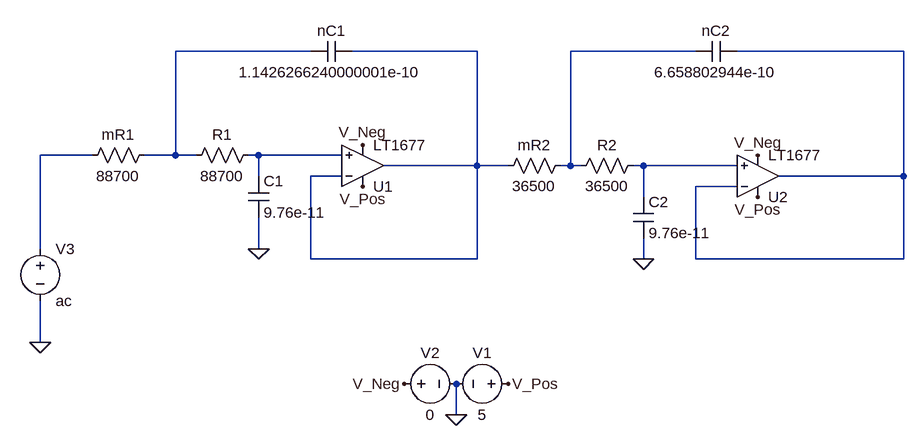
[diagram p0: schematic UnityGain4thOrderFilter.asc]
UnityGain4thOrderFilter.asc, the LTspice schematic file:
Version 4
SHEET 1 1728 680
WIRE 496 64 288 64
WIRE 752 64 560 64
WIRE 1088 64 896 64
WIRE 1408 64 1152 64
WIRE 160 224 80 224
WIRE 288 224 288 64
WIRE 288 224 240 224
WIRE 320 224 288 224
WIRE 416 224 400 224
WIRE 544 224 416 224
WIRE 752 240 752 64
WIRE 752 240 608 240
WIRE 800 240 752 240
WIRE 896 240 896 64
WIRE 896 240 880 240
WIRE 912 240 896 240
WIRE 1008 240 992 240
WIRE 1152 240 1008 240
WIRE 416 256 416 224
WIRE 544 256 496 256
WIRE 1408 256 1408 64
WIRE 1408 256 1216 256
WIRE 1152 272 1088 272
WIRE 1008 288 1008 240
WIRE 80 368 80 224
WIRE 416 368 416 320
WIRE 496 384 496 256
WIRE 752 384 752 240
WIRE 752 384 496 384
WIRE 1008 384 1008 352
WIRE 1088 384 1088 272
WIRE 1408 384 1408 256
WIRE 1408 384 1088 384
WIRE 80 512 80 448
WIRE 720 624 720 576
FLAG 416 368 0
FLAG 1008 384 0
FLAG 720 624 0
FLAG 800 576 V_Pos
FLAG 640 576 V_Neg
FLAG 80 512 0
FLAG 1184 288 V_Pos
FLAG 576 272 V_Pos
FLAG 576 208 V_Neg
FLAG 1184 224 V_Neg
SYMBOL res 256 208 R90
WINDOW 0 0 56 VBottom 2
WINDOW 3 32 56 VTop 2
SYMATTR InstName mR1
SYMATTR Value 88700
SYMBOL res 416 208 R90
WINDOW 0 0 56 VBottom 2
WINDOW 3 32 56 VTop 2
SYMATTR InstName R1
SYMATTR Value 88700
SYMBOL cap 400 256 R0
SYMATTR InstName C1
SYMATTR Value 9.76e-11
SYMBOL cap 560 48 R90
WINDOW 0 0 32 VBottom 2
WINDOW 3 32 32 VTop 2
SYMATTR InstName nC1
SYMATTR Value 1.1426266240000001e-10
SYMBOL res 896 224 R90
WINDOW 0 0 56 VBottom 2
WINDOW 3 32 56 VTop 2
SYMATTR InstName mR2
SYMATTR Value 36500
SYMBOL res 1008 224 R90
WINDOW 0 0 56 VBottom 2
WINDOW 3 32 56 VTop 2
SYMATTR InstName R2
SYMATTR Value 36500
SYMBOL cap 1152 48 R90
WINDOW 0 0 32 VBottom 2
WINDOW 3 32 32 VTop 2
SYMATTR InstName nC2
SYMATTR Value 6.658802944e-10
SYMBOL cap 992 288 R0
SYMATTR InstName C2
SYMATTR Value 9.76e-11
SYMBOL voltage 816 576 R90
WINDOW 0 -32 56 VBottom 2
WINDOW 3 32 56 VTop 2
SYMATTR InstName V1
SYMATTR Value 5
SYMBOL voltage 624 576 R270
WINDOW 0 32 56 VTop 2
WINDOW 3 -32 56 VBottom 2
SYMATTR InstName V2
SYMATTR Value 0
SYMBOL voltage 80 352 R0
WINDOW 123 0 0 Left 0
WINDOW 39 0 0 Left 0
SYMATTR InstName V3
SYMATTR Value ac
SYMBOL Opamps\\LT1677 576 304 M180
SYMATTR InstName U1
SYMBOL Opamps\\LT1677 1184 320 M180
SYMATTR InstName U2

The netlist it stands for:
* UnityGain4thOrderFilter.asc
R§mR1 N001 N005 88700
R1 N006 N001 88700
C1 N006 0 9.76e-11
C§nC1 N002 N001 1.1426266240000001e-10
R§mR2 N003 N002 36500
R2 N007 N003 36500
C§nC2 N004 N003 6.658802944e-10
C2 N007 0 9.76e-11
V1 V_Pos 0 5
V2 V_Neg 0 0
V3 N005 0 ac
XU1 N006 N002 V_Pos V_Neg N002 LT1677  ; pins In+ In- V+ V- OUT
XU2 N007 N004 V_Pos V_Neg N004 LT1677  ; pins In+ In- V+ V- OUT
.lib LTC.lib
.backanno
.end